# EAGLE design BusCon (EAGLE 6.6.0)
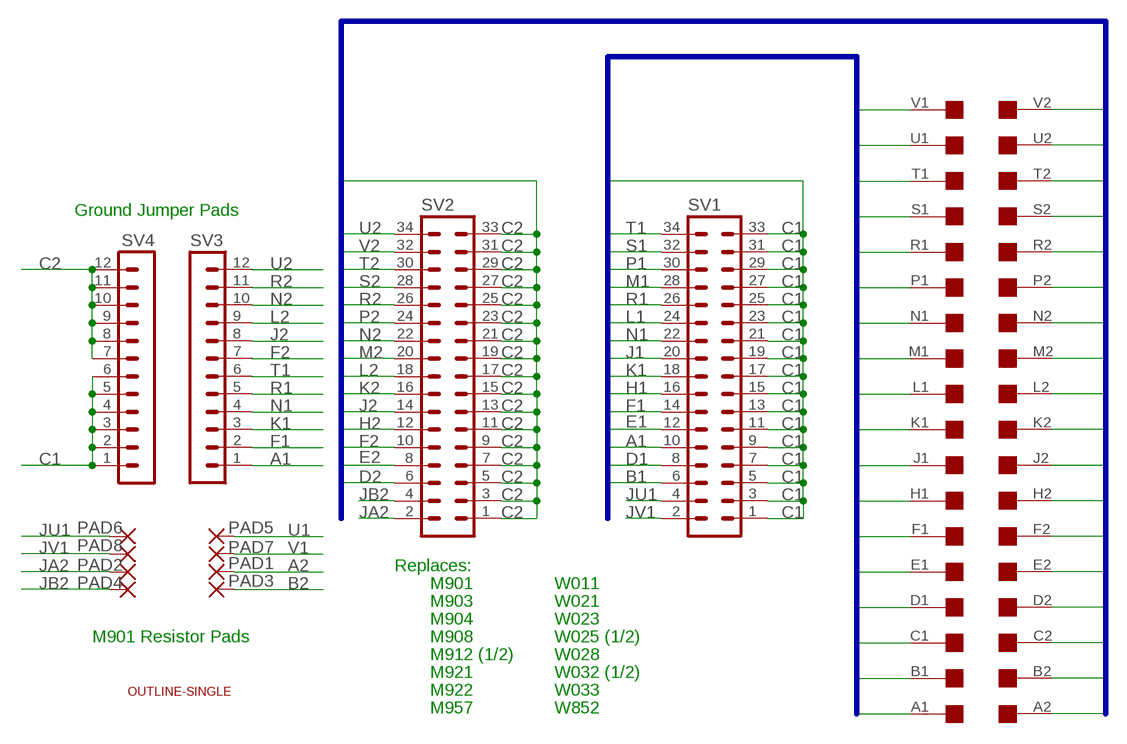
[diagram p0: schematic, sheet 1]

## Parts
PAD1  1,6/0,8  [1,6/0,8]
PAD2  1,6/0,8  [1,6/0,8]
PAD3  1,6/0,8  [1,6/0,8]
PAD4  1,6/0,8  [1,6/0,8]
PAD5  1,6/0,8  [1,6/0,8]
PAD6  1,6/0,8  [1,6/0,8]
PAD7  1,6/0,8  [1,6/0,8]
PAD8  1,6/0,8  [1,6/0,8]
SV1  MA17-2  [MA17-2]
SV2  MA17-2  [MA17-2]
SV3  MA12-1  [MA12-1]
SV4  MA12-1  [MA12-1]
U$1  OUTLINE-SINGLE  [SINGLE]
U$4  EDGE-2CONNECTOR  [EDGE-CON2]

## Nets
A1: SV1.10 SV3.1 U$4.A1
A2: PAD1.1(P) U$4.A2
B1: SV1.6 U$4.B1
B2: PAD3.1(P) U$4.B2
C1: SV1.1 SV1.3 SV1.5 SV1.7 SV1.9 SV1.11 SV1.13 SV1.15 SV1.17 SV1.19 SV1.21 SV1.23 SV1.25 SV1.27 SV1.29 SV1.31 SV1.33 SV4.1 SV4.2 SV4.3 SV4.4 SV4.5 SV4.6 U$4.C1
C2: SV2.1 SV2.3 SV2.5 SV2.7 SV2.9 SV2.11 SV2.13 SV2.15 SV2.17 SV2.19 SV2.21 SV2.23 SV2.25 SV2.27 SV2.29 SV2.31 SV2.33 SV4.7 SV4.8 SV4.9 SV4.10 SV4.11 SV4.12 U$4.C2
D1: SV1.8 U$4.D1
D2: SV2.6 U$4.D2
E1: SV1.12 U$4.E1
E2: SV2.8 U$4.E2
F1: SV1.14 SV3.2 U$4.F1
F2: SV2.10 SV3.7 U$4.F2
H1: SV1.16 U$4.H1
H2: SV2.12 U$4.H2
J1: SV1.20 U$4.J1
J2: SV2.14 SV3.8 U$4.J2
JA2: PAD2.1(P) SV2.2
JB2: PAD4.1(P) SV2.4
JU1: PAD6.1(P) SV1.4
JV1: PAD8.1(P) SV1.2
K1: SV1.18 SV3.3 U$4.K1
K2: SV2.16 U$4.K2
L1: SV1.24 U$4.L1
L2: SV2.18 SV3.9 U$4.L2
M1: SV1.28 U$4.M1
M2: SV2.20 U$4.M2
N1: SV1.22 SV3.4 U$4.N1
N2: SV2.22 SV3.10 U$4.N2
P1: SV1.30 U$4.P1
P2: SV2.24 U$4.P2
R1: SV1.26 SV3.5 U$4.R1
R2: SV2.26 SV3.11 U$4.R2
S1: SV1.32 U$4.S1
S2: SV2.28 U$4.S2
T1: SV1.34 SV3.6 U$4.T1
T2: SV2.30 U$4.T2
U1: PAD5.1(P) U$4.U1
U2: SV2.34 SV3.12 U$4.U2
V1: PAD7.1(P) U$4.V1
V2: SV2.32 U$4.V2

## Buses
A1,B1,C1,D1,E1,F1,H1,J1,K1,L1,M1,N1,P1,R1,S1,T1,U1,V1
A2,B2,C2,D2,E2,F2,H2,J2,K2,L2,M2,N2,P2,R2,S2,T2,U2,V2

## Notes on the sheet
- Ground Jumper Pads
- Replaces:
- M901 | W011
- M903 | W021
- M904 | W023
- M901 Resistor Pads | M908 | W025 (1/2)
- M912 (1/2) | W028
- M921 | W032 (1/2)
- M922 | W033
- M957 | W852

## Library data of the parts
PAD1-PAD8 = wirepad:1,6/0,8: THROUGH-HOLE PAD
SV1 SV2 = con-lstb:MA17-2: PIN HEADER; OC_FARNELL: unknown; OC_NEWARK: unknown
SV3 SV4 = con-lstb:MA12-1: PIN HEADER; OC_FARNELL: unknown; OC_NEWARK: unknown
U$1 = dec-con:OUTLINE-*: Board outlines for DEC boards.
U$4 = dec-con:EDGE-2: Double-Sided DEC edge connector.

## Board
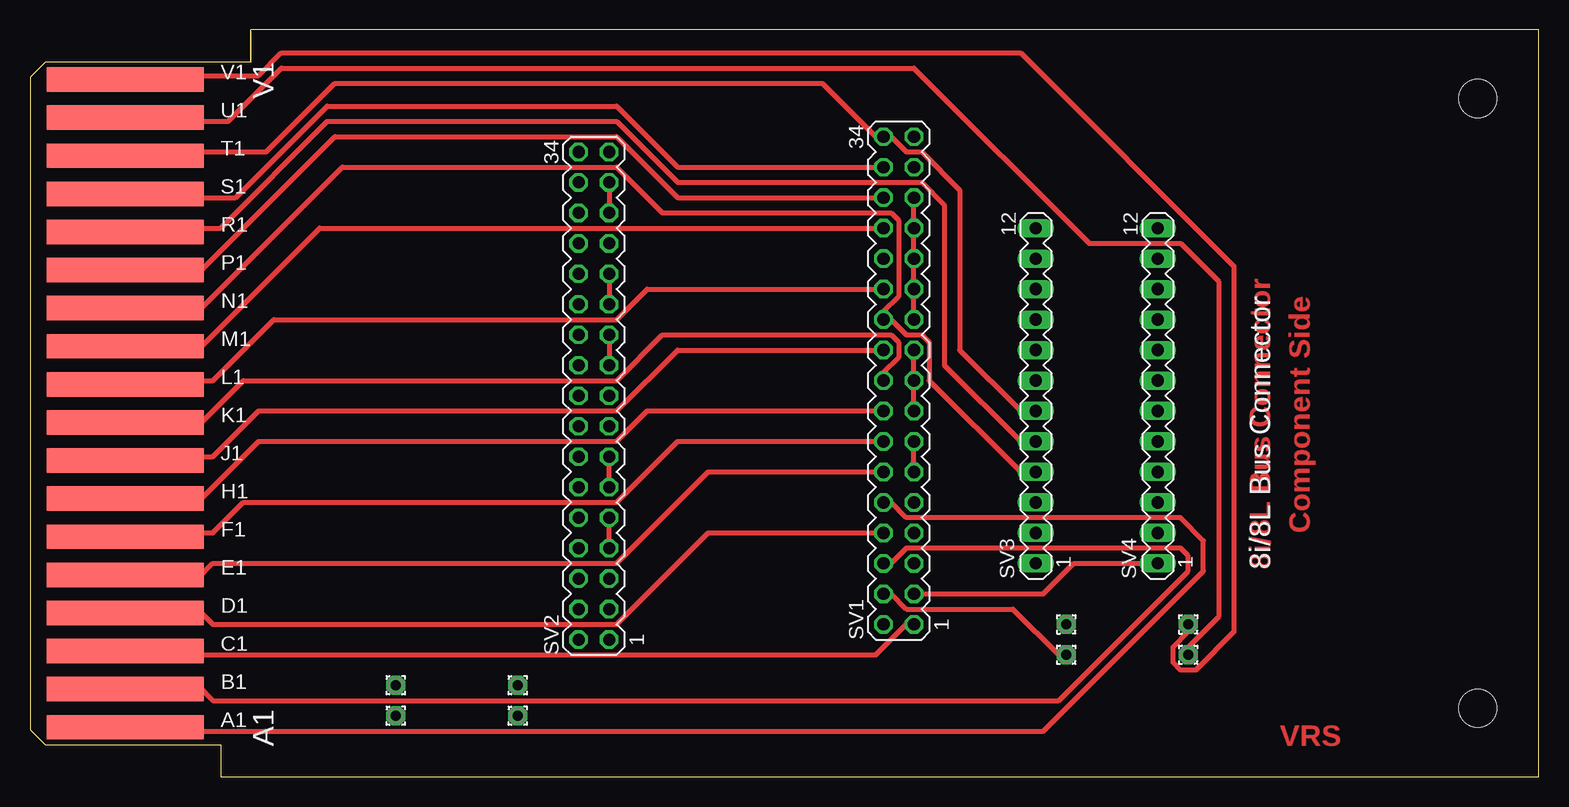
[diagram p1: board, top side]
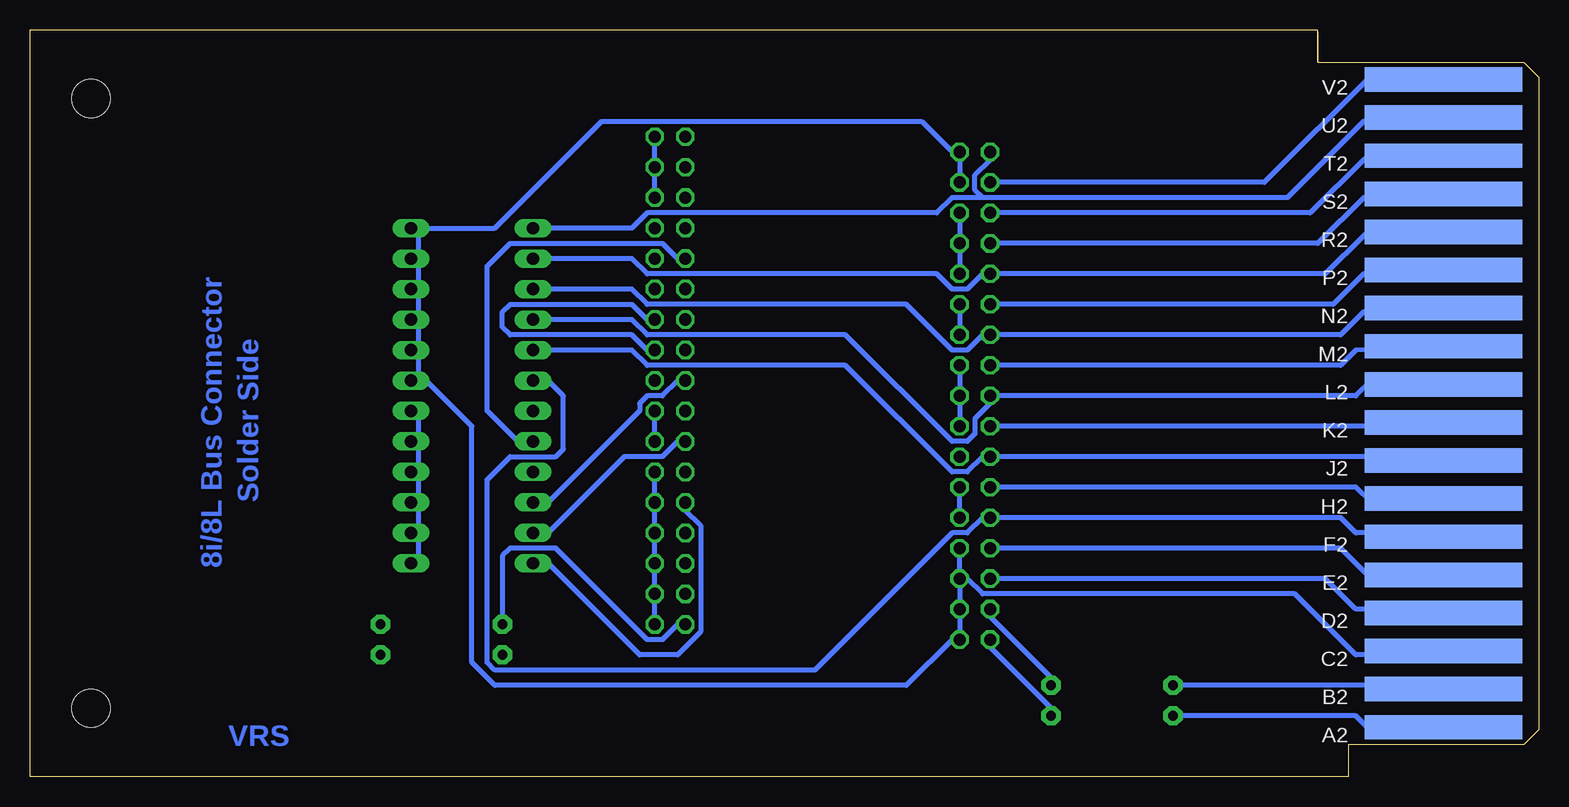
[diagram p2: board, bottom side, seen from below]

Size 125.73 x 62.23 mm. Coordinates in mm from the lower left corner, seen from the top.
Copper layers (1+16): Top 0.035mm / dielectric 1.5mm / Bottom 0.035mm
Design rules "16mils": minimum track width 16mil, minimum drill 32mil, track to track 15mil, track to pad 10mil, pad to pad 10mil, via to via 10mil, smd to smd 10mil, copper to edge 13mil, drill to drill 10mil, minimum pad ring 10mil, minimum via ring 8mil, stop-mask expansion 0mil, vias tented up to drill 0mil, thermal gap 10mil

### Footprints (pad centres in the part's own frame; a part is rotated, then mirrored left to right if it is on the bottom)
1,6/0,8 = drill 0.813 pad 1.6 octagon: 1 0,0
MA17-2 = drill 1.016 octagon: 1 -20.32,-1.27; 2 -20.32,1.27; 3 -17.78,-1.27; 4 -17.78,1.27; 5 -15.24,-1.27; 6 -15.24,1.27; 7 -12.7,-1.27; 8 -12.7,1.27; 9 -10.16,-1.27; 10 -10.16,1.27; 11 -7.62,-1.27; 12 -7.62,1.27; 13 -5.08,-1.27; 14 -5.08,1.27; 15 -2.54,-1.27; 16 -2.54,1.27; 17 0,-1.27; 18 0,1.27; 19 2.54,-1.27; 20 2.54,1.27; 21 5.08,-1.27; 22 5.08,1.27; 23 7.62,-1.27; 24 7.62,1.27; 25 10.16,-1.27; 26 10.16,1.27; 27 12.7,-1.27; 28 12.7,1.27; 29 15.24,-1.27; 30 15.24,1.27; 31 17.78,-1.27; 32 17.78,1.27; 33 20.32,-1.27; 34 20.32,1.27
MA12-1 = drill 1.016 long: 1 -13.97,0; 2 -11.43,0; 3 -8.89,0; 4 -6.35,0; 5 -3.81,0; 6 -1.27,0; 7 1.27,0; 8 3.81,0; 9 6.35,0; 10 8.89,0; 11 11.43,0; 12 13.97,0
SINGLE = hole 3.175: 120.65,56.515; 120.65,5.715
EDGE-CON2 = smd 13.106 x 2.032: A1 7.938,4.128; B1 7.938,7.303; C1 7.938,10.477; D1 7.938,13.652; E1 7.938,16.828; F1 7.938,20.003; H1 7.938,23.177; J1 7.938,26.352; K1 7.938,29.527; L1 7.938,32.703; M1 7.938,35.877; N1 7.938,39.053; P1 7.938,42.227; R1 7.938,45.403; S1 7.938,48.578; T1 7.938,51.752; U1 7.938,54.928; V1 7.938,58.102 | smd 13.106 x 2.032 bottom: A2 7.938,4.128; B2 7.938,7.303; C2 7.938,10.477; D2 7.938,13.652; E2 7.938,16.828; F2 7.938,20.003; H2 7.938,23.177; J2 7.938,26.352; K2 7.938,29.527; L2 7.938,32.703; M2 7.938,35.877; N2 7.938,39.053; P2 7.938,42.227; R2 7.938,45.403; S2 7.938,48.578; T2 7.938,51.752; U2 7.938,54.928; V2 7.938,58.102

### Placement (x,y rotation side)
PAD1  30.48,5.08 0 top
PAD2  40.64,5.08 0 top
PAD3  30.48,7.62 0 top
PAD4  40.64,7.62 0 top
PAD5  96.52,10.16 180 top
PAD6  86.36,10.16 180 top
PAD7  96.52,12.7 180 top
PAD8  86.36,12.7 180 top
SV1  72.39,33.02 90 top
SV2  46.99,31.75 90 top
SV3  83.82,31.75 90 top
SV4  93.98,31.75 90 top
U$1  0,0 0 top
U$4  0,0 0 top

### Tracks (layer width: path | path; a pad name or v marks a point on that pad's centre or on a via)
A1
  Top 0.406: SV1.10 71.76,22.86 73.03,21.59 95.89,21.59 97.79,19.68 97.79,17.14 84.46,3.81 13.97,3.81 U$4.A1
  Bottom 0.406: SV1.10 71.12,22.23 69.85,20.95 69.85,12.06 71.76,10.16 74.93,10.16 82.55,17.78 SV3.1
A2
  Bottom 0.406: PAD1.1 15.24,5.08 13.97,3.81 U$4.A2
B1
  Top 0.406: SV1.6 71.76,17.78 73.03,19.05 95.89,19.05 96.52,18.41 96.52,17.14 85.73,6.35 15.24,6.35 13.97,7.62 U$4.B1
B2
  Bottom 0.406: PAD3.1 29.85,7.62 13.97,7.62 U$4.B2
C1
  Top 0.406: SV1.21 73.66,38.73 73.66,40.01 SV1.23 73.66,41.27 73.66,42.55 SV1.25 73.66,43.81 73.66,45.09 SV1.27 73.66,46.35 73.66,47.62 SV1.29 | SV1.15 73.66,31.11 73.66,32.38 SV1.17 73.66,33.66 73.66,34.92 SV1.19 | SV1.13 73.66,27.3 73.66,26.04 SV1.11 | SV4.1 92.71,17.78 87,17.78 84.46,15.24 74.3,15.24 SV1.3 | U$4.C1 13.97,10.16 70.49,10.16 73.03,12.7 SV1.1
  Bottom 0.406: SV1.29 73.66,48.9 73.66,50.16 SV1.31 73.66,51.44 73.66,52.7 SV1.33 | SV4.1 93.35,18.41 93.35,19.68 SV4.2 93.35,20.95 93.35,22.23 SV4.3 93.35,23.5 93.35,24.77 SV4.4 93.35,26.04 93.35,27.3 SV4.5 93.35,28.57 93.35,29.84 SV4.6 | SV1.13 73.66,28.57 73.66,29.84 SV1.15 | SV1.1 73.66,13.34 73.66,14.61 SV1.3 73.66,15.88 73.66,17.14 SV1.5 73.66,18.41 73.66,19.68 SV1.7 73.66,20.95 73.66,22.23 SV1.9 73.66,23.5 73.66,24.77 SV1.11 | SV1.21 74.3,38.1 75.57,39.37 85.73,39.37 86.36,38.73 86.36,37.47 85.73,36.83 75.57,36.83 74.3,35.56 SV1.19
C2
  Top 0.406: SV2.21 SV2.19 | SV2.31 SV2.29 | SV2.25 SV2.23 | SV2.11 SV2.13 | SV2.7 SV2.9
  Bottom 0.406: SV2.23 SV2.21 | SV2.15 SV2.17 SV2.19 | SV2.31 SV2.33 48.9,52.07 51.44,54.61 78.11,54.61 87,45.72 SV4.12 93.35,45.09 93.35,43.81 SV4.11 93.35,42.55 93.35,41.27 SV4.10 93.35,40.01 93.35,38.73 SV4.9 93.35,37.47 93.35,36.2 SV4.8 93.35,34.92 93.35,33.66 SV4.7 92.71,33.02 88.9,29.21 88.9,9.53 87,7.62 52.71,7.62 48.9,11.43 SV2.1 SV2.3 SV2.5 | SV2.25 SV2.27 SV2.29 | SV2.9 SV2.11 | SV2.5 SV2.7 | SV2.5 47.63,16.51 46.36,15.24 20.32,15.24 15.24,10.16 13.97,10.16 U$4.C2
D1
  Top 0.406: SV1.8 56.52,20.32 48.9,12.7 15.24,12.7 13.97,13.97 U$4.D1
D2
  Bottom 0.406: SV2.6 17.78,16.51 15.24,13.97 13.97,13.97 U$4.D2
E1
  Top 0.406: SV1.12 56.52,25.4 48.9,17.78 15.24,17.78 13.97,16.51 U$4.E1
E2
  Bottom 0.406: SV2.8 16.51,19.05 13.97,16.51 U$4.E2
F1
  Top 0.406: SV1.14 53.98,27.94 48.9,22.86 17.78,22.86 15.24,20.32 13.97,20.32 U$4.F1
  Bottom 0.406: SV1.14 71.76,27.94 73.03,26.67 76.2,26.67 82.55,20.32 SV3.2
F2
  Bottom 0.406: U$4.F2 13.97,20.32 15.24,20.32 15.88,20.95 16.51,21.59 SV2.10 46.36,21.59 47.63,20.32 48.9,20.32 60.33,8.89 87,8.89 87.63,9.53 87.63,24.77 85.73,26.67 81.92,26.67 81.28,27.3 81.28,31.75 82.55,33.02 SV3.7
H1
  Top 0.406: SV1.16 51.44,30.48 48.9,27.94 19.05,27.94 13.97,22.86 U$4.H1
H2
  Bottom 0.406: SV2.12 15.24,24.13 13.97,22.86 U$4.H2
J1
  Top 0.406: SV1.20 53.98,35.56 48.9,30.48 19.05,30.48 15.24,26.67 13.97,26.67 U$4.J1
J2
  Bottom 0.406: U$4.J2 13.97,26.67 45.09,26.67 SV2.14 46.36,26.67 47.63,25.4 48.9,25.4 57.79,34.29 74.3,34.29 75.57,35.56 82.55,35.56 SV3.8
JA2
  Bottom 0.406: SV2.2 45.72,10.79 40.64,5.71 PAD2.1
JB2
  Bottom 0.406: SV2.4 45.72,13.34 40.64,8.26 PAD4.1
JU1
  Top 0.406: SV1.4 71.76,15.24 73.03,13.97 81.92,13.97 85.73,10.16 PAD6.1
JV1
  Bottom 0.406: SV1.2 71.76,12.7 73.03,11.43 74.3,11.43 81.92,19.05 85.73,19.05 86.36,18.41 86.36,13.34 PAD8.1
K1
  Top 0.406: SV1.18 71.12,33.66 72.39,34.92 72.39,36.2 71.76,36.83 52.71,36.83 48.9,33.02 17.78,33.02 14.61,29.84 13.97,29.21 U$4.K1
  Bottom 0.406: SV3.3 82.55,22.86 74.93,30.48 74.93,31.11 74.3,31.75 73.03,31.75 71.76,33.02 SV1.18
K2
  Bottom 0.406: SV2.16 45.09,29.21 13.97,29.21 U$4.K2
L1
  Top 0.406: SV1.24 51.44,40.64 48.9,38.1 20.32,38.1 15.24,33.02 13.97,33.02 U$4.L1
L2
  Bottom 0.406: U$4.L2 13.97,33.02 15.24,31.75 SV2.18 45.72,31.11 46.99,29.84 46.99,28.57 47.63,27.94 48.9,27.94 57.79,36.83 74.3,36.83 75.57,38.1 SV3.9
M1
  Top 0.406: SV1.28 24.13,45.72 13.97,35.56 U$4.M1
M2
  Bottom 0.406: SV2.20 16.51,34.29 15.24,35.56 U$4.M2
N1
  Top 0.406: SV3.4 82.55,25.4 74.93,33.02 74.93,36.2 74.3,36.83 73.03,36.83 71.76,38.1 SV1.22 71.12,38.73 72.39,40.01 72.39,46.35 71.76,46.99 52.71,46.99 48.9,50.8 26.04,50.8 13.97,38.73 U$4.N1
N2
  Bottom 0.406: U$4.N2 14.61,38.73 16.51,36.83 SV2.22 46.36,36.83 47.63,35.56 48.9,35.56 52.71,39.37 74.3,39.37 75.57,40.64 SV3.10
P1
  Top 0.406: SV1.30 53.98,48.26 48.9,53.34 25.4,53.34 14.61,42.55 13.97,41.91 U$4.P1
P2
  Bottom 0.406: SV2.24 17.15,39.37 14.61,41.91 13.97,41.91 U$4.P2
R1
  Top 0.406: SV3.5 82.55,27.94 76.2,34.29 76.2,47.62 74.3,49.53 53.98,49.53 48.9,54.61 24.77,54.61 15.88,45.72 13.97,45.72 U$4.R1
  Bottom 0.406: SV1.26 71.76,43.18 73.03,44.45 85.73,44.45 87.63,42.55 87.63,30.48 85.09,27.94 SV3.5
R2
  Bottom 0.406: U$4.R2 13.97,45.72 14.61,45.09 17.78,41.91 SV2.26 46.36,41.91 47.63,40.64 48.9,40.64 50.17,41.91 74.3,41.91 75.57,43.18 SV3.11
S1
  Top 0.406: SV1.32 53.98,50.8 48.9,55.88 24.77,55.88 17.15,48.26 12.7,48.26 U$4.S1
S2
  Bottom 0.406: SV2.28 18.42,44.45 14.61,48.26 13.97,48.26 U$4.S2
T1
  Top 0.406: SV3.6 82.55,30.48 77.47,35.56 77.47,48.9 74.3,52.07 73.03,52.07 71.76,53.34 SV1.34 70.49,53.34 66.04,57.78 25.4,57.78 19.69,52.07 13.34,52.07 U$4.T1
T2
  Bottom 0.406: SV2.30 19.05,46.99 14.61,51.44 13.97,52.07 U$4.T2
U1
  Top 0.406: PAD5.1 96.52,10.79 99.06,13.34 99.06,41.27 95.89,44.45 88.27,44.45 73.66,59.05 20.96,59.05 16.51,54.61 12.7,54.61 U$4.U1
U2
  Bottom 0.406: 46.36,48.26 46.99,48.9 46.99,50.16 45.72,51.44 SV2.34 | 46.36,48.26 20.96,48.26 14.61,54.61 13.97,54.61 U$4.U2 | SV3.12 75.57,45.72 74.3,46.99 50.17,46.99 48.9,48.26 46.36,48.26
V1
  Top 0.406: PAD7.1 96.52,12.06 95.25,10.79 95.25,9.53 95.89,8.89 97.16,8.89 100.33,12.06 100.33,42.55 82.55,60.33 20.96,60.33 19.05,58.42 13.97,58.42 U$4.V1
V2
  Bottom 0.406: SV2.32 22.86,49.53 13.97,58.42 U$4.V2

### Text on the board
Top: Component Side | 8i/8L Bus Connector | VRS
Bottom: Solder Side | 8i/8L Bus Connector | VRS
tPlace: 8i/8L Bus Connector
tNames: V1 | A1
tValues: * | * | * | * | * | * | * | * | * | * | * | * | * | * | * | * | Jumper unless M901 | * | * | M90x/W0x1 - always used | M901/M903/M904 - Use both | M901 | 10ohm | M901 | * - Posibus/Negibus Signal | 10ohm